# EAGLE schematic avr-usb-ptt (EAGLE 6.1)
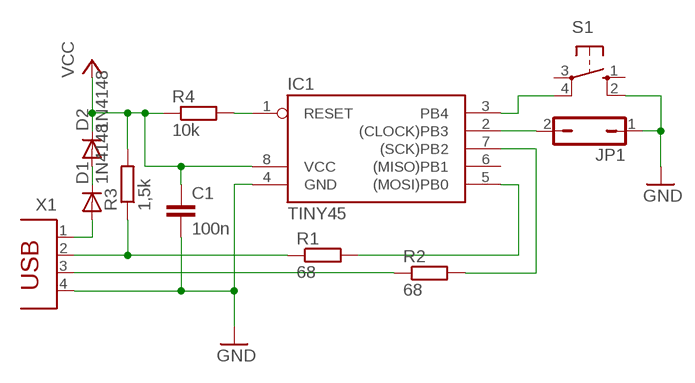
[diagram p0: schematic, sheet 1]

## Parts
C1  100n  C-EU050-024X044  [C050-024X044]
D1  1N4148  1N4148DO35-7  [DO35-7]
D2  1N4148  1N4148DO35-7  [DO35-7]
IC1  TINY45  TINY22P  [DIL08]
JP1  JP1Q  [JP1]
R1  68  R-EU_0207/10  [0207/10]
R2  68  R-EU_0207/10  [0207/10]
R3  1,5k  R-EU_0207/10  [0207/10]
R4  10k  R-EU_0207/10  [0207/10]
S1  10-XX  [B3F-10XX]
X1  PN61729  [PN61729]

## Nets
GND: C1.2 IC1.4(GND) JP1.1 S1.2(S1) X1.4
N$1: IC1.2((CLOCK)PB3) JP1.2
N$2: IC1.3(PB4) S1.4(P1)
N$4: R1.1 R3.1 X1.2
N$5: R2.1 X1.3
N$6: IC1.5((MOSI)PB0) R1.2
N$7: IC1.7((SCK)PB2) R2.2
N$8: D1.C D2.A
N$10: D1.A X1.1
N$11: IC1.1(RESET) R4.2
VCC: C1.1 D2.C IC1.8(VCC) R3.2 R4.1
Unconnected: IC1.6((MISO)PB1) S1.1(S) S1.3(P)

## Library data of the parts
C1 = rcl:C-EU: CAPACITOR, European symbol
D1 D2 = diode:1N4148: DIODE high speed (Philips)
IC1 = atmel:TINY22: MICROCONTROLLER 1K ROM 128 bytes RAM 128 bytes EEPROM; OC_FARNELL: unknown; OC_NEWARK: unknown
JP1 = jumper:JP1Q: JUMPER
R1-R4 = rcl:R-EU_: RESISTOR, European symbol
S1 = switch-omron:10-XX: OMRON SWITCH; MPN: B3F-1000; OC_FARNELL: 176432; OC_NEWARK: 36M3542
X1 = con-berg:PN61729: BERG USB connector; OC_FARNELL: unknown; OC_NEWARK: unknown